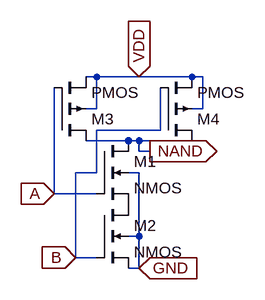
[diagram p0: schematic NAND.asc]
NAND.asc, the LTspice schematic file:
Version 4
SHEET 1 880 680
WIRE 128 128 112 128
WIRE 192 128 128 128
WIRE 272 128 192 128
WIRE 288 128 272 128
WIRE 128 176 128 128
WIRE 128 176 112 176
WIRE 288 176 288 128
WIRE 288 176 272 176
WIRE 224 208 224 144
WIRE 224 208 128 208
WIRE 176 224 112 224
WIRE 192 224 176 224
WIRE 272 224 192 224
WIRE 192 240 192 224
WIRE 208 240 192 240
WIRE 128 272 128 208
WIRE 128 272 96 272
WIRE 192 272 176 272
WIRE 64 304 64 144
WIRE 128 304 64 304
WIRE 192 368 192 272
WIRE 192 368 176 368
WIRE 96 400 96 272
WIRE 128 400 96 400
WIRE 192 416 192 368
WIRE 192 416 176 416
FLAG 64 304 A
IOPIN 64 304 In
FLAG 96 400 B
IOPIN 96 400 In
FLAG 192 128 VDD
IOPIN 192 128 In
FLAG 192 416 GND
IOPIN 192 416 In
FLAG 208 240 NAND
IOPIN 208 240 Out
SYMBOL nmos4 128 224 R0
SYMATTR InstName M1
SYMBOL nmos4 128 320 R0
SYMATTR InstName M2
SYMBOL pmos4 64 224 M180
SYMATTR InstName M3
SYMBOL pmos4 224 224 M180
SYMATTR InstName M4

The netlist it stands for:
* NAND.asc
M1 NAND A P001 GND NMOS
M2 P001 B GND GND NMOS
M3 NAND A VDD VDD PMOS
M4 NAND B VDD VDD PMOS
.model NMOS NMOS
.model PMOS PMOS
.lib standard.mos
.backanno
.end